# Altium project S7CAS-PLEIADES-CARTE-MERE_P02.PrjPCB (part 3 of 3)

## Sheet S7CAS-PLEIADES-CARTE-MERE_P02_CLOCKS.SchDoc
size Tabloid; DocumentNumber: 12; SheetNumber: 12; SheetTotal: 14; Size: 11x17; Sheet_Name: Horloge
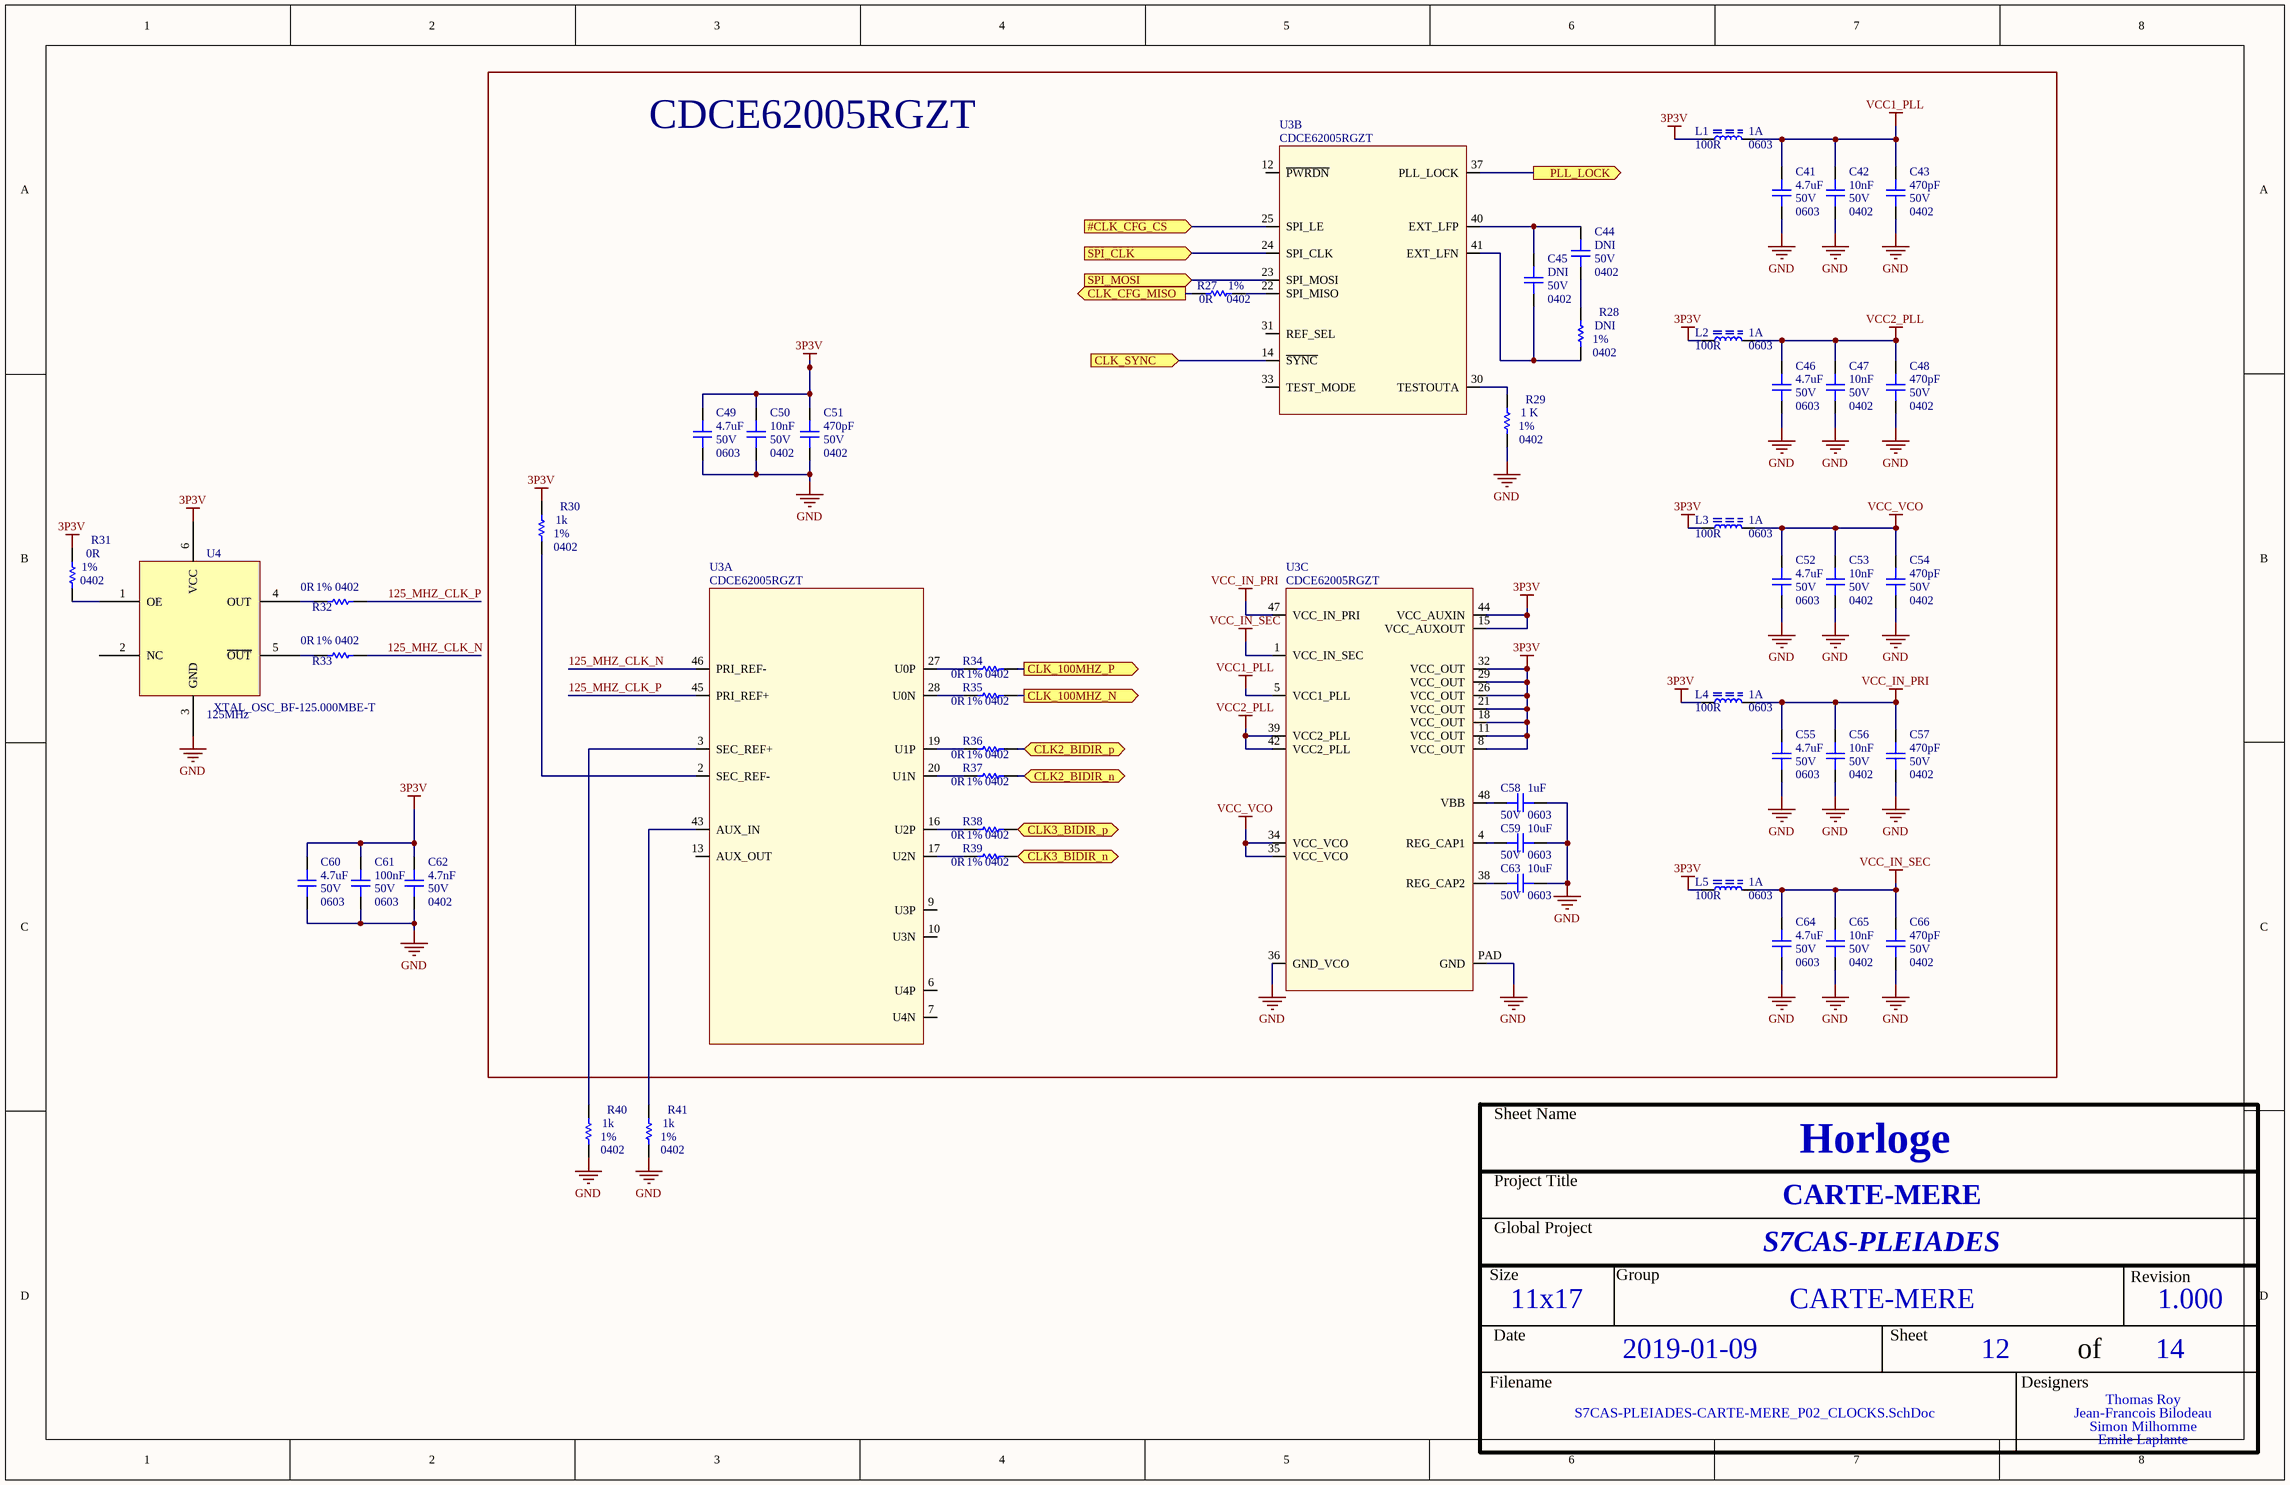
[diagram p10: S7CAS-PLEIADES-CARTE-MERE_P02_CLOCKS.SchDoc]

### Parts
C41  value 4.7uF  Voltage: 50V  Package: 0603  [CAP_0603]  (hidden comment: CAP - 0603)
C42  value 10nF  Voltage: 50V  Package: 0402  [CAP_0402]  (hidden comment: CAP - 0603)
C43  value 470pF  Voltage: 50V  Package: 0402  [CAP_0402]  (hidden comment: CAP - 0603)
C44  value DNI  Voltage: 50V  Package: 0402  [CAP_0402]  (hidden comment: CAP - 0603)
C45  value DNI  Voltage: 50V  Package: 0402  [CAP_0402]  (hidden comment: CAP - 0603)
C46  value 4.7uF  Voltage: 50V  Package: 0603  [CAP_0603]  (hidden comment: CAP - 0603)
C47  value 10nF  Voltage: 50V  Package: 0402  [CAP_0402]  (hidden comment: CAP - 0603)
C48  value 470pF  Voltage: 50V  Package: 0402  [CAP_0402]  (hidden comment: CAP - 0603)
C49  value 4.7uF  Voltage: 50V  Package: 0603  [CAP_0603]  (hidden comment: CAP - 0603)
C50  value 10nF  Voltage: 50V  Package: 0402  [CAP_0402]  (hidden comment: CAP - 0603)
C51  value 470pF  Voltage: 50V  Package: 0402  [CAP_0402]  (hidden comment: CAP - 0603)
C52  value 4.7uF  Voltage: 50V  Package: 0603  [CAP_0603]  (hidden comment: CAP - 0603)
C53  value 10nF  Voltage: 50V  Package: 0402  [CAP_0402]  (hidden comment: CAP - 0603)
C54  value 470pF  Voltage: 50V  Package: 0402  [CAP_0402]  (hidden comment: CAP - 0603)
C55  value 4.7uF  Voltage: 50V  Package: 0603  [CAP_0603]  (hidden comment: CAP - 0603)
C56  value 10nF  Voltage: 50V  Package: 0402  [CAP_0402]  (hidden comment: CAP - 0603)
C57  value 470pF  Voltage: 50V  Package: 0402  [CAP_0402]  (hidden comment: CAP - 0603)
C58  value 1uF  Voltage: 50V  Package: 0603  [CAP_0603]  (hidden comment: CAP - 0603)
C59  value 10uF  Voltage: 50V  Package: 0603  [CAP_0603]  (hidden comment: CAP - 0603)
C60  value 4.7uF  Voltage: 50V  Package: 0603  [CAP_0603]  (hidden comment: CAP - 0603)
C61  value 100nF  Voltage: 50V  Package: 0603  [CAP_0603]  (hidden comment: CAP - 0603)
C62  value 4.7nF  Voltage: 50V  Package: 0402  [CAP_0402]  (hidden comment: CAP - 0603)
C63  value 10uF  Voltage: 50V  Package: 0603  [CAP_0603]  (hidden comment: CAP - 0603)
C64  value 4.7uF  Voltage: 50V  Package: 0603  [CAP_0603]  (hidden comment: CAP - 0603)
C65  value 10nF  Voltage: 50V  Package: 0402  [CAP_0402]  (hidden comment: CAP - 0603)
C66  value 470pF  Voltage: 50V  Package: 0402  [CAP_0402]  (hidden comment: CAP - 0603)
L1  value 100R  Current: 1A  Package: 0603  [FER_0603]  (hidden comment: FER - 0603)
L2  value 100R  Current: 1A  Package: 0603  [FER_0603]  (hidden comment: FER - 0603)
L3  value 100R  Current: 1A  Package: 0603  [FER_0603]  (hidden comment: FER - 0603)
L4  value 100R  Current: 1A  Package: 0603  [FER_0603]  (hidden comment: FER - 0603)
L5  value 100R  Current: 1A  Package: 0603  [FER_0603]  (hidden comment: FER - 0603)
R27  value 0R  Package: 0402  Precision: 1%  [RES_0402]  (hidden comment: RES - 0402)
R28  value DNI  Package: 0402  Precision: 1%  [RES_0402]  (hidden comment: RES - 0402)
R29  value 1 K  Package: 0402  Precision: 1%  [RES_0402]  (hidden comment: RES - 0402)
R30  value 1k  Package: 0402  Precision: 1%  [RES_0402]  (hidden comment: RES - 0402)
R31  value 0R  Package: 0402  Precision: 1%  [RES_0402]  (hidden comment: RES - 0402)
R32  value 0R  Package: 0402  Precision: 1%  [RES_0402]  (hidden comment: RES - 0402)
R33  value 0R  Package: 0402  Precision: 1%  [RES_0402]  (hidden comment: RES - 0402)
R34  value 0R  Package: 0402  Precision: 1%  [RES_0402]  (hidden comment: RES - 0402)
R35  value 0R  Package: 0402  Precision: 1%  [RES_0402]  (hidden comment: RES - 0402)
R36  value 0R  Package: 0402  Precision: 1%  [RES_0402]  (hidden comment: RES - 0402)
R37  value 0R  Package: 0402  Precision: 1%  [RES_0402]  (hidden comment: RES - 0402)
R38  value 0R  Package: 0402  Precision: 1%  [RES_0402]  (hidden comment: RES - 0402)
R39  value 0R  Package: 0402  Precision: 1%  [RES_0402]  (hidden comment: RES - 0402)
R40  value 1k  Package: 0402  Precision: 1%  [RES_0402]  (hidden comment: RES - 0402)
R41  value 1k  Package: 0402  Precision: 1%  [RES_0402]  (hidden comment: RES - 0402)
U3  CDCE62005RGZT  [TIM_CDCE62005RGZT]  (parts A,B,C of 3)
U4  XTAL_OSC_BF-125.000MBE-T  Parameter 1: 125MHz  [BF-125.000MBE-T]

### Blocks framed on the sheet
CDCE62005RGZT: C41-C59 C63-C66 L1-L5 R27-R30 R34-R39 U3

### Ports
#CLK_CFG_CS (in), CLK2_BIDIR_n (bidir), CLK2_BIDIR_p (bidir), CLK3_BIDIR_n (bidir), CLK3_BIDIR_p (bidir), CLK_100MHZ_N (out), CLK_100MHZ_P (out), CLK_CFG_MISO (out), CLK_SYNC (in), PLL_LOCK (out), SPI_CLK (in), SPI_MOSI (in)

### Nets
3P3V: C49.2 C50.2 C51.2 C60.2 C61.2 C62.2 L1.2 L2.2 L3.2 L4.2 L5.2 R30.2 R31.1 U3.8(VCC_OUT) U3.11(VCC_OUT) U3.15(VCC_AUXOUT) U3.18(VCC_OUT) U3.21(VCC_OUT) U3.26(VCC_OUT) U3.29(VCC_OUT) U3.32(VCC_OUT) U3.44(VCC_AUXIN) U4.6(VCC)
GND: C41.1 C42.1 C43.1 C46.1 C47.1 C48.1 C49.1 C50.1 C51.1 C52.1 C53.1 C54.1 C55.1 C56.1 C57.1 C58.1 C59.1 C60.1 C61.1 C62.1 C63.1 C64.1 C65.1 C66.1 R29.1 R40.1 R41.1 U3.36(GND_VCO) U3.PAD(GND) U4.3(GND)
VCC1_PLL: C41.2 C42.2 C43.2 L1.1 U3.5(VCC1_PLL)
VCC2_PLL: C46.2 C47.2 C48.2 L2.1 U3.39(VCC2_PLL) U3.42(VCC2_PLL)
VCC_IN_PRI: C55.2 C56.2 C57.2 L4.1 U3.47(VCC_IN_PRI)
VCC_IN_SEC: C64.2 C65.2 C66.2 L5.1 U3.1(VCC_IN_SEC)
VCC_VCO: C52.2 C53.2 C54.2 L3.1 U3.34(VCC_VCO) U3.35(VCC_VCO)
125_MHZ_CLK_N: R33.1 U3.46(PRI_REF-)
125_MHZ_CLK_P: R32.1 U3.45(PRI_REF+)
#CLK_CFG_CS: U3.25(SPI_LE) ; port #CLK_CFG_CS
CLK2_BIDIR_n: R37.1 ; port CLK2_BIDIR_n
CLK2_BIDIR_p: R36.1 ; port CLK2_BIDIR_p
CLK3_BIDIR_n: R39.1 ; port CLK3_BIDIR_n
CLK3_BIDIR_p: R38.1 ; port CLK3_BIDIR_p
CLK_100MHZ_N: R35.1 ; port CLK_100MHZ_N
CLK_100MHZ_P: R34.1 ; port CLK_100MHZ_P
CLK_CFG_MISO: R27.2 ; port CLK_CFG_MISO
CLK_SYNC: U3.14(~{SYNC}) ; port CLK_SYNC
PLL_LOCK: U3.37(PLL_LOCK) ; port PLL_LOCK
SPI_CLK: U3.24(SPI_CLK) ; port SPI_CLK
SPI_MOSI: U3.23(SPI_MOSI) ; port SPI_MOSI
NetC44_1: C44.1 R28.2
NetC44_2: C44.2 C45.2 U3.40(EXT_LFP)
NetC45_1: C45.1 R28.1 U3.41(EXT_LFN)
NetC58_2: C58.2 U3.48(VBB)
NetC59_2: C59.2 U3.4(REG_CAP1)
NetC63_2: C63.2 U3.38(REG_CAP2)
NetR27_1: R27.1 U3.22(SPI_MISO)
NetR29_2: R29.2 U3.30(TESTOUTA)
NetR30_1: R30.1 U3.2(SEC_REF-)
NetR31_2: R31.2 U4.1(OE)
NetR32_2: R32.2 U4.4(OUT)
NetR33_2: R33.2 U4.5(~{OUT})
NetR34_2: R34.2 U3.27(U0P)
NetR35_2: R35.2 U3.28(U0N)
NetR36_2: R36.2 U3.19(U1P)
NetR37_2: R37.2 U3.20(U1N)
NetR38_2: R38.2 U3.16(U2P)
NetR39_2: R39.2 U3.17(U2N)
NetR40_2: R40.2 U3.3(SEC_REF+)
NetR41_2: R41.2 U3.43(AUX_IN)

Not connected (* = marked no-connect by the designer): U3 6(U4P) 7(U4N) 9(U3P) 10(U3N) 12(~{PWRDN}) 13(AUX_OUT) 31(REF_SEL) 33(TEST_MODE); U4 2(NC)

### Notes on the sheet
- Sheet Name
- Project Title
- Global Project
- Size
- Group
- Revision
- Date
- Sheet
- of
- Filename
- Designers

### Library data of the parts
C41-C66 = CAP - 0603: Precision: 10%; Current: *; CreatedBy: Jonathan Bouchard; Power: *
R27-R41 = RES - 0402: Voltage: 50V; Power: 1/16W; Current: *; CreatedBy: Jonathan Bouchard
U3 = TIM_CDCE62005RGZT: TIM - CLK SYNTH JITTER CLEANER 3:5 - QFN-48; Voltage: 3 V ~ 3.6 V; Mfg: Texas Instruments; Current: *; Power: *; Mfg Part Number: CDCE62005RGZT; HelpURL: http://www.ti.com/lit/ds/symlink/cdce62005.pdf; CreatedBy: Jonathan Bouchard; Temperature: -40°C ~ 85°C; Value: *; Precision: *; Package: QFN-48; Supplier 1: Digikey; Supplier Part Number 1: 296-23947-1-ND
L1-L5 = FER - 0603: Voltage: *; CreatedBy: Jonathan Bouchard; Power: *; Precision: *

## Sheet S7CAS-PLEIADES-CARTE-MERE_P02_FLASH.SchDoc
size Tabloid; DocumentNumber: 13; SheetNumber: 13; SheetTotal: 14; Size: 11x17; Sheet_Name: Flash
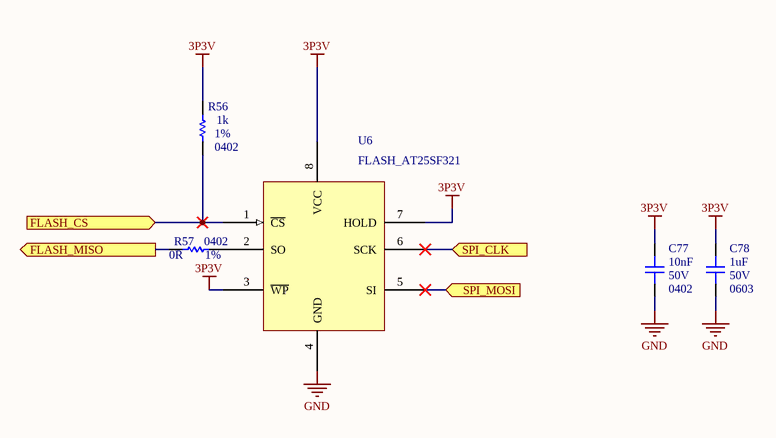
[diagram p11: S7CAS-PLEIADES-CARTE-MERE_P02_FLASH.SchDoc]

### Parts
C77  value 10nF  Voltage: 50V  Package: 0402  [CAP_0402]  (hidden comment: CAP - 0603)
C78  value 1uF  Voltage: 50V  Package: 0603  [CAP_0603]  (hidden comment: CAP - 0603)
R56  value 1k  Package: 0402  Precision: 1%  [RES_0402]  (hidden comment: RES - 0402)
R57  value 0R  Package: 0402  Precision: 1%  [RES_0402]  (hidden comment: RES - 0402)
U6  FLASH_AT25SF321  [8-SOIC]

### Ports
FLASH_CS (in), FLASH_MISO (out), SPI_CLK (in), SPI_MOSI (in)

### Nets
3P3V: C77.2 C78.2 R56.2 U6.3(~{WP}) U6.7(HOLD) U6.8(VCC)
GND: C77.1 C78.1 U6.4(GND)
FLASH_CS: R56.1 U6.1(~{CS}) ; port FLASH_CS
FLASH_MISO: R57.2 ; port FLASH_MISO
SPI_CLK: U6.6(SCK) ; port SPI_CLK
SPI_MOSI: U6.5(SI) ; port SPI_MOSI
NetR57_1: R57.1 U6.2(SO)

### Notes on the sheet
- Sheet Name
- Project Title
- Global Project
- Size
- Group
- Revision
- Date
- Sheet
- of
- Filename
- Designers

### Library data of the parts
C77 C78 = CAP - 0603: Precision: 10%; Current: *; CreatedBy: Jonathan Bouchard; Power: *
R56 R57 = RES - 0402: Voltage: 50V; Power: 1/16W; Current: *; CreatedBy: Jonathan Bouchard

## Sheet S7CAS-PLEIADES-CARTE-MERE_P02_USER_IO.SchDoc
size Tabloid; DocumentNumber: 14; SheetNumber: 14; SheetTotal: 14; Sheet_Name: User IO; Size: 11x17
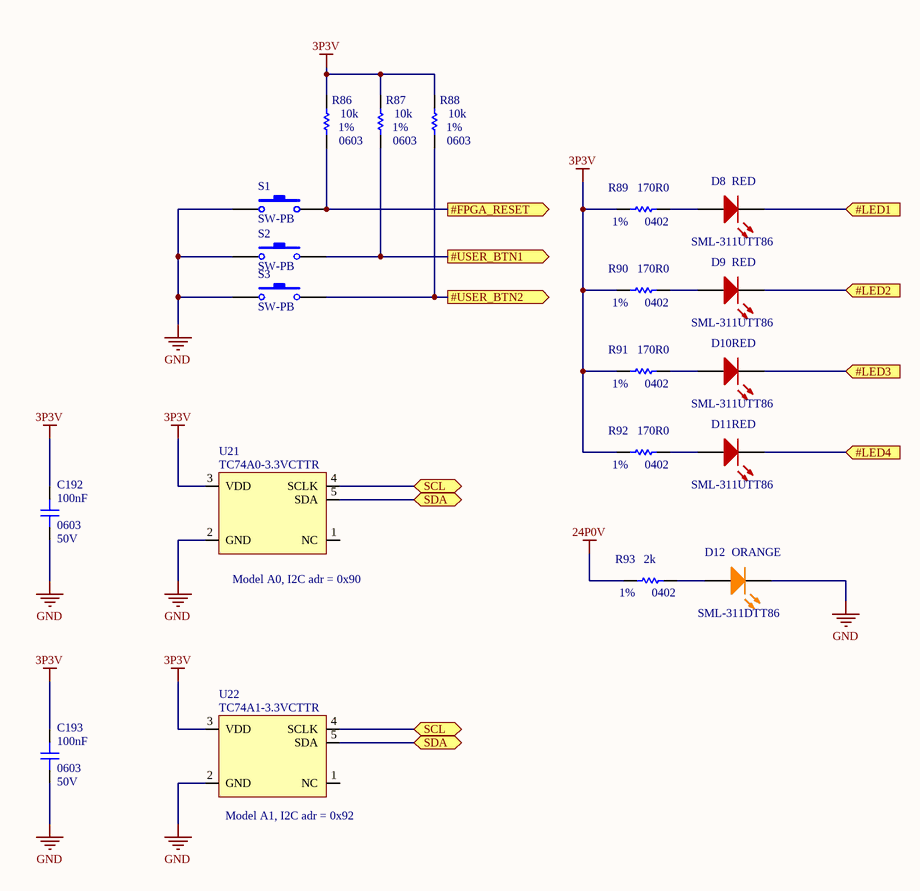
[diagram p12: S7CAS-PLEIADES-CARTE-MERE_P02_USER_IO.SchDoc]

### Parts
C192  value 100nF  Voltage: 50V  Package: 0603  [CAP_0603]  (hidden comment: CAP - 0603)
C193  value 100nF  Voltage: 50V  Package: 0603  [CAP_0603]  (hidden comment: CAP - 0603)
D8  SML-311UTT86  value RED  [LED_0603]
D9  SML-311UTT86  value RED  [LED_0603]
D10  SML-311UTT86  value RED  [LED_0603]
D11  SML-311UTT86  value RED  [LED_0603]
D12  SML-311DTT86  value ORANGE  [LED_0603]
R86  value 10k  Package: 0603  Precision: 1%  [RES_0603]  (hidden comment: RES - 0603)
R87  value 10k  Package: 0603  Precision: 1%  [RES_0603]  (hidden comment: RES - 0603)
R88  value 10k  Package: 0603  Precision: 1%  [RES_0603]  (hidden comment: RES - 0603)
R89  value 170R0  Package: 0402  Precision: 1%  [RES_0402]  (hidden comment: RES - 0402)
R90  value 170R0  Package: 0402  Precision: 1%  [RES_0402]  (hidden comment: RES - 0402)
R91  value 170R0  Package: 0402  Precision: 1%  [RES_0402]  (hidden comment: RES - 0402)
R92  value 170R0  Package: 0402  Precision: 1%  [RES_0402]  (hidden comment: RES - 0402)
R93  value 2k  Package: 0402  Precision: 1%  [RES_0402]  (hidden comment: RES - 0402)
S1  SW-PB  [SPST-2]
S2  SW-PB  [SPST-2]
S3  SW-PB  [SPST-2]
U21  TC74A0-3.3VCTTR  [SEN_TEMP_TC74A0-3.3VCTTR]
U22  TC74A1-3.3VCTTR  [SEN_TEMP_TC74A0-3.3VCTTR]

### Ports
#FPGA_RESET (out), #LED1 (in), #LED2 (in), #LED3 (in), #LED4 (in), #USER_BTN1 (out), #USER_BTN2 (out), SCL (bidir), SDA (bidir)

### Nets
3P3V: C192.2 C193.2 R86.2 R87.2 R88.2 R89.2 R90.2 R91.2 R92.2 U21.3(VDD) U22.3(VDD)
24P0V: R93.2
GND: C192.1 C193.1 D12.K S1.1 S2.1 S3.1 U21.2(GND) U22.2(GND)
#FPGA_RESET: R86.1 S1.2 ; port #FPGA_RESET
#LED1: D8.K ; port #LED1
#LED2: D9.K ; port #LED2
#LED3: D10.K ; port #LED3
#LED4: D11.K ; port #LED4
#USER_BTN1: R87.1 S2.2 ; port #USER_BTN1
#USER_BTN2: R88.1 S3.2 ; port #USER_BTN2
SCL: U21.4(SCLK) U22.4(SCLK) ; port SCL
SDA: U21.5(SDA) U22.5(SDA) ; port SDA
NetD8_A: D8.A R89.1
NetD9_A: D9.A R90.1
NetD10_A: D10.A R91.1
NetD11_A: D11.A R92.1
NetD12_A: D12.A R93.1

Not connected (* = marked no-connect by the designer): U21 1(NC); U22 1(NC)

### Notes on the sheet
- (near U21) Model A0, I2C adr = 0x90
- (near U22) Model A1, I2C adr = 0x92
- Sheet Name
- Project Title
- Global Project
- Size
- Group
- Revision
- Date
- Sheet
- of
- Filename
- Designers

### Library data of the parts
C192 C193 = CAP - 0603: Precision: 10%; Current: *; CreatedBy: Jonathan Bouchard; Power: *
D8-D11 = LED_SML-311UTT86: LED - 620nM RED 2mA - 0603; Voltage: 1.8V; Mfg: ROHM Semiconductor; Power: 44mW; Current: 2mA; HelpURL: http://media.digikey.com/pdf/Data%20Sheets/Rohm%20PDFs/SML-311%20Series.pdf; CreatedBy: Jonathan Bouchard; Temperature: -30°C to 85°C; Package: 0603; Precision: *; Mfg Part Number: SML-311UTT86; Supplier 1: Digikey; Supplier Part Number 1: 511-1304-1-ND
D12 = LED_SML-311DTT86: LED - 611nM ORANGE 2mA - 0603; Voltage: 1.8V; Mfg: ROHM Semiconductor; Power: 44mW; Current: 2mA; HelpURL: http://media.digikey.com/pdf/Data%20Sheets/Rohm%20PDFs/SML-311%20Series.pdf; CreatedBy: Jonathan Bouchard; Temperature: -40°C to 85°C; Package: 0603; Precision: *; Mfg Part Number: SML-311DTT86; Supplier 1: Digikey; Supplier Part Number 1: 511-1303-1-ND
R89-R93 = RES - 0402: Voltage: 50V; Power: 1/16W; Current: *; CreatedBy: Jonathan Bouchard
S1-S3 = SW-PB: Switch; Published: 24-Mar-1999; LatestRevisionDate: 17-Jul-2002; LatestRevisionNote: Re-released for DXP Platform.; PackageReference: SPST-2; Publisher: Altium Limited; PackageDescription: Switch; 2 Leads
U21 U22 = SENS_TEMP_TC74A0-3.3VCTTR: SENS - TEMPERATURE SENSOR I2C/SMBUS - SOT23-5; Voltage: 2.7 V ~ 5.5 V; Mfg: Microchip; Precision: ±2°C (±3°C); Current: *; Power: *; Mfg Part Number: TC74A0-3.3VCTTR; HelpURL: http://ww1.microchip.com/downloads/en/DeviceDoc/21462D.pdf; CreatedBy: Jonathan Bouchard; Temperature: -40°C ~ 125°C; Value: *; Package: SOT23-5; Supplier 1: Digikey; Supplier Part Number 1: TC74A0-3.3VCTDKR-ND
R86-R88 = RES - 0603: Current: *; CreatedBy: Jonathan Bouchard

## Nets that join several sheets
0P75V: S7CAS-PLEIADES-CARTE-MERE_P02_POWER_CARRIER (5 pins), S7CAS-PLEIADES-CARTE-MERE_P02_DDR3 (24 pins)
1P2V: S7CAS-PLEIADES-CARTE-MERE_P02_POWER_CARRIER (5 pins), S7CAS-PLEIADES-CARTE-MERE_P02_FPGA_B4B5 (31 pins)
1P5V: S7CAS-PLEIADES-CARTE-MERE_P02_POWER_CARRIER (10 pins), S7CAS-PLEIADES-CARTE-MERE_P02_FPGA_B2B3 (15 pins), S7CAS-PLEIADES-CARTE-MERE_P02_DDR3 (30 pins)
2P5V: S7CAS-PLEIADES-CARTE-MERE_P02_POWER (10 pins), S7CAS-PLEIADES-CARTE-MERE_P02_POWER_CARRIER (C174.2 C175.2 D7.2 U17.3), S7CAS-PLEIADES-CARTE-MERE_P02_USB (C187.2 J5.B01 R85.2)
3P3V: S7CAS-PLEIADES-CARTE-MERE_P02_POWER (C141.2 C142.2 D5.2 U11.3), S7CAS-PLEIADES-CARTE-MERE_P02_POWER_CARRIER (10 pins), S7CAS-PLEIADES-CARTE-MERE_P02_FPGA_B0B1 (16 pins), S7CAS-PLEIADES-CARTE-MERE_P02_FPGA_B2B3 (15 pins), S7CAS-PLEIADES-CARTE-MERE_P02_FPGA_B4B5 (30 pins), S7CAS-PLEIADES-CARTE-MERE_P02_MOTOR_CTRL (C110.1 L7.2 U7.10), S7CAS-PLEIADES-CARTE-MERE_P02_ETHERNET (7 pins), S7CAS-PLEIADES-CARTE-MERE_P02_USB (8 pins), S7CAS-PLEIADES-CARTE-MERE_P02_CLOCKS (23 pins), S7CAS-PLEIADES-CARTE-MERE_P02_FLASH (6 pins), S7CAS-PLEIADES-CARTE-MERE_P02_USER_IO (11 pins)
3P3V_VITA: S7CAS-PLEIADES-CARTE-MERE_P02_POWER (7 pins), S7CAS-PLEIADES-CARTE-MERE_P02_CONNECTORS (J1.C39 J1.D36 J1.D38 J1.D40)
3P3VAUX: S7CAS-PLEIADES-CARTE-MERE_P02_POWER (6 pins), S7CAS-PLEIADES-CARTE-MERE_P02_CONNECTORS (J1.D32)
5P0V: S7CAS-PLEIADES-CARTE-MERE_P02_POWER (C136.2 C137.2 D4.2 U10.3), S7CAS-PLEIADES-CARTE-MERE_P02_POWER_CARRIER (11 pins)
12P0V: S7CAS-PLEIADES-CARTE-MERE_P02_POWER (C127.1 C128.1 U8.5), S7CAS-PLEIADES-CARTE-MERE_P02_CONNECTORS (J1.C35 J1.C37)
24P0V: S7CAS-PLEIADES-CARTE-MERE_P02_POWER (14 pins), S7CAS-PLEIADES-CARTE-MERE_P02_POWER_CARRIER (10 pins), S7CAS-PLEIADES-CARTE-MERE_P02_MOTOR_CTRL (6 pins), S7CAS-PLEIADES-CARTE-MERE_P02_USER_IO (R93.2)
GND: S7CAS-PLEIADES-CARTE-MERE_P02_POWER (42 pins), S7CAS-PLEIADES-CARTE-MERE_P02_POWER_CARRIER (45 pins), S7CAS-PLEIADES-CARTE-MERE_P02_CONNECTORS (159 pins), S7CAS-PLEIADES-CARTE-MERE_P02_FPGA_B0B1 (11 pins), S7CAS-PLEIADES-CARTE-MERE_P02_FPGA_B2B3 (10 pins), S7CAS-PLEIADES-CARTE-MERE_P02_FPGA_B4B5 (89 pins), S7CAS-PLEIADES-CARTE-MERE_P02_DDR3 (43 pins), S7CAS-PLEIADES-CARTE-MERE_P02_MOTOR_CTRL (20 pins), S7CAS-PLEIADES-CARTE-MERE_P02_ETHERNET (20 pins), S7CAS-PLEIADES-CARTE-MERE_P02_USB (16 pins), S7CAS-PLEIADES-CARTE-MERE_P02_CLOCKS (30 pins), S7CAS-PLEIADES-CARTE-MERE_P02_FLASH (C77.1 C78.1 U6.4), S7CAS-PLEIADES-CARTE-MERE_P02_USER_IO (8 pins)
VADJ: S7CAS-PLEIADES-CARTE-MERE_P02_POWER (6 pins), S7CAS-PLEIADES-CARTE-MERE_P02_CONNECTORS (J1.E39 J1.F40 J1.G39 J1.H40)
VIO_B_M2C: S7CAS-PLEIADES-CARTE-MERE_P02_CONNECTORS (J1.J39 J1.K40), S7CAS-PLEIADES-CARTE-MERE_P02_FPGA_B0B1 (17 pins)
VREF_0V75: S7CAS-PLEIADES-CARTE-MERE_P02_POWER_CARRIER (C182.2 U16.6), S7CAS-PLEIADES-CARTE-MERE_P02_FPGA_B2B3 (U2.AD7 U2.L6 U2.R6 U2.V6), S7CAS-PLEIADES-CARTE-MERE_P02_DDR3 (5 pins)
#CLK_CFG_CS: S7CAS-PLEIADES-CARTE-MERE_P02_FPGA_B2B3 (U2.AE19), S7CAS-PLEIADES-CARTE-MERE_P02_CLOCKS (U3.25)
#FPGA_RESET: S7CAS-PLEIADES-CARTE-MERE_P02_FPGA_B2B3 (U2.AF3), S7CAS-PLEIADES-CARTE-MERE_P02_USER_IO (R86.1 S1.2)
#LED1: S7CAS-PLEIADES-CARTE-MERE_P02_FPGA_B2B3 (U2.Y15), S7CAS-PLEIADES-CARTE-MERE_P02_USER_IO (D8.K)
#LED2: S7CAS-PLEIADES-CARTE-MERE_P02_FPGA_B2B3 (U2.AA15), S7CAS-PLEIADES-CARTE-MERE_P02_USER_IO (D9.K)
#LED3: S7CAS-PLEIADES-CARTE-MERE_P02_FPGA_B2B3 (U2.Y14), S7CAS-PLEIADES-CARTE-MERE_P02_USER_IO (D10.K)
#LED4: S7CAS-PLEIADES-CARTE-MERE_P02_FPGA_B2B3 (U2.AA14), S7CAS-PLEIADES-CARTE-MERE_P02_USER_IO (D11.K)
#MOTOR_ENABLE: S7CAS-PLEIADES-CARTE-MERE_P02_FPGA_B0B1 (U2.R21), S7CAS-PLEIADES-CARTE-MERE_P02_MOTOR_CTRL (U7.26)
#MOTOR_RESET: S7CAS-PLEIADES-CARTE-MERE_P02_FPGA_B0B1 (U2.R22), S7CAS-PLEIADES-CARTE-MERE_P02_MOTOR_CTRL (U7.17)
#MOTOR_SLEEP: S7CAS-PLEIADES-CARTE-MERE_P02_FPGA_B0B1 (U2.P17), S7CAS-PLEIADES-CARTE-MERE_P02_MOTOR_CTRL (U7.27)
#MOTOR_SR: S7CAS-PLEIADES-CARTE-MERE_P02_FPGA_B0B1 (U2.T22), S7CAS-PLEIADES-CARTE-MERE_P02_MOTOR_CTRL (U7.16)
#PHY_RST: S7CAS-PLEIADES-CARTE-MERE_P02_FPGA_B0B1 (U2.M18), S7CAS-PLEIADES-CARTE-MERE_P02_ETHERNET (C73.1 R44.1 U5.32)
#USER_BTN1: S7CAS-PLEIADES-CARTE-MERE_P02_FPGA_B2B3 (U2.AB15), S7CAS-PLEIADES-CARTE-MERE_P02_USER_IO (R87.1 S2.2)
#USER_BTN2: S7CAS-PLEIADES-CARTE-MERE_P02_FPGA_B2B3 (U2.AC14), S7CAS-PLEIADES-CARTE-MERE_P02_USER_IO (R88.1 S3.2)
CK_N: S7CAS-PLEIADES-CARTE-MERE_P02_FPGA_B2B3 (U2.R3), S7CAS-PLEIADES-CARTE-MERE_P02_DDR3 (R18.2 U1.K7)
CK_P: S7CAS-PLEIADES-CARTE-MERE_P02_FPGA_B2B3 (U2.R4), S7CAS-PLEIADES-CARTE-MERE_P02_DDR3 (R18.1 U1.J7)
CLK0_M2C_n: S7CAS-PLEIADES-CARTE-MERE_P02_CONNECTORS (J1.H5), S7CAS-PLEIADES-CARTE-MERE_P02_FPGA_B0B1 (U2.M21)
CLK0_M2C_p: S7CAS-PLEIADES-CARTE-MERE_P02_CONNECTORS (J1.H4), S7CAS-PLEIADES-CARTE-MERE_P02_FPGA_B0B1 (U2.N20)
CLK1_M2C_n: S7CAS-PLEIADES-CARTE-MERE_P02_CONNECTORS (J1.G3), S7CAS-PLEIADES-CARTE-MERE_P02_FPGA_B0B1 (U2.P22)
CLK1_M2C_p: S7CAS-PLEIADES-CARTE-MERE_P02_CONNECTORS (J1.G2), S7CAS-PLEIADES-CARTE-MERE_P02_FPGA_B0B1 (U2.P21)
CLK2_BIDIR_n: S7CAS-PLEIADES-CARTE-MERE_P02_CONNECTORS (J1.K5), S7CAS-PLEIADES-CARTE-MERE_P02_FPGA_B2B3 (U2.AF13), S7CAS-PLEIADES-CARTE-MERE_P02_CLOCKS (R37.1)
CLK2_BIDIR_p: S7CAS-PLEIADES-CARTE-MERE_P02_CONNECTORS (J1.K4), S7CAS-PLEIADES-CARTE-MERE_P02_FPGA_B2B3 (U2.AE13), S7CAS-PLEIADES-CARTE-MERE_P02_CLOCKS (R36.1)
CLK3_BIDIR_n: S7CAS-PLEIADES-CARTE-MERE_P02_CONNECTORS (J1.J3), S7CAS-PLEIADES-CARTE-MERE_P02_FPGA_B2B3 (U2.AF14), S7CAS-PLEIADES-CARTE-MERE_P02_CLOCKS (R39.1)
CLK3_BIDIR_p: S7CAS-PLEIADES-CARTE-MERE_P02_CONNECTORS (J1.J2), S7CAS-PLEIADES-CARTE-MERE_P02_FPGA_B2B3 (U2.AD14), S7CAS-PLEIADES-CARTE-MERE_P02_CLOCKS (R38.1)
CLK_100MHZ_N: S7CAS-PLEIADES-CARTE-MERE_P02_FPGA_B0B1 (U2.W24), S7CAS-PLEIADES-CARTE-MERE_P02_CLOCKS (R35.1)
CLK_100MHZ_P: S7CAS-PLEIADES-CARTE-MERE_P02_FPGA_B0B1 (U2.V23), S7CAS-PLEIADES-CARTE-MERE_P02_CLOCKS (R34.1)
CLK_CFG_MISO: S7CAS-PLEIADES-CARTE-MERE_P02_FPGA_B2B3 (U2.AF20), S7CAS-PLEIADES-CARTE-MERE_P02_CLOCKS (R27.2)
CLK_DIR: S7CAS-PLEIADES-CARTE-MERE_P02_CONNECTORS (J1.B1), S7CAS-PLEIADES-CARTE-MERE_P02_FPGA_B2B3 (U2.AF19)
CLK_SYNC: S7CAS-PLEIADES-CARTE-MERE_P02_FPGA_B2B3 (U2.AC16), S7CAS-PLEIADES-CARTE-MERE_P02_CLOCKS (U3.14)
DDR3_A0: S7CAS-PLEIADES-CARTE-MERE_P02_FPGA_B2B3 (U2.N7), S7CAS-PLEIADES-CARTE-MERE_P02_DDR3 (R1.1 U1.N3)
DDR3_A1: S7CAS-PLEIADES-CARTE-MERE_P02_FPGA_B2B3 (U2.N6), S7CAS-PLEIADES-CARTE-MERE_P02_DDR3 (R2.1 U1.P7)
DDR3_A2: S7CAS-PLEIADES-CARTE-MERE_P02_FPGA_B2B3 (U2.R9), S7CAS-PLEIADES-CARTE-MERE_P02_DDR3 (R3.1 U1.P3)
DDR3_A3: S7CAS-PLEIADES-CARTE-MERE_P02_FPGA_B2B3 (U2.P7), S7CAS-PLEIADES-CARTE-MERE_P02_DDR3 (R4.1 U1.N2)
DDR3_A4: S7CAS-PLEIADES-CARTE-MERE_P02_FPGA_B2B3 (U2.N9), S7CAS-PLEIADES-CARTE-MERE_P02_DDR3 (R5.1 U1.P8)
DDR3_A5: S7CAS-PLEIADES-CARTE-MERE_P02_FPGA_B2B3 (U2.R2), S7CAS-PLEIADES-CARTE-MERE_P02_DDR3 (R6.1 U1.P2)
DDR3_A6: S7CAS-PLEIADES-CARTE-MERE_P02_FPGA_B2B3 (U2.R1), S7CAS-PLEIADES-CARTE-MERE_P02_DDR3 (R7.1 U1.R8)
DDR3_A7: S7CAS-PLEIADES-CARTE-MERE_P02_FPGA_B2B3 (U2.P10), S7CAS-PLEIADES-CARTE-MERE_P02_DDR3 (R8.1 U1.R2)
DDR3_A8: S7CAS-PLEIADES-CARTE-MERE_P02_FPGA_B2B3 (U2.N4), S7CAS-PLEIADES-CARTE-MERE_P02_DDR3 (R9.1 U1.T8)
DDR3_A9: S7CAS-PLEIADES-CARTE-MERE_P02_FPGA_B2B3 (U2.N3), S7CAS-PLEIADES-CARTE-MERE_P02_DDR3 (R10.1 U1.R3)
DDR3_A10: S7CAS-PLEIADES-CARTE-MERE_P02_FPGA_B2B3 (U2.M10), S7CAS-PLEIADES-CARTE-MERE_P02_DDR3 (R11.1 U1.L7)
DDR3_A11: S7CAS-PLEIADES-CARTE-MERE_P02_FPGA_B2B3 (U2.L3), S7CAS-PLEIADES-CARTE-MERE_P02_DDR3 (R12.1 U1.R7)
DDR3_A12: S7CAS-PLEIADES-CARTE-MERE_P02_FPGA_B2B3 (U2.M8), S7CAS-PLEIADES-CARTE-MERE_P02_DDR3 (R13.1 U1.N7)
DDR3_A13: S7CAS-PLEIADES-CARTE-MERE_P02_FPGA_B2B3 (U2.M6), S7CAS-PLEIADES-CARTE-MERE_P02_DDR3 (R14.1 U1.T3)
DDR3_BA0: S7CAS-PLEIADES-CARTE-MERE_P02_FPGA_B2B3 (U2.P3), S7CAS-PLEIADES-CARTE-MERE_P02_DDR3 (R15.1 U1.M2)
DDR3_BA1: S7CAS-PLEIADES-CARTE-MERE_P02_FPGA_B2B3 (U2.P1), S7CAS-PLEIADES-CARTE-MERE_P02_DDR3 (R16.1 U1.N8)
DDR3_BA2: S7CAS-PLEIADES-CARTE-MERE_P02_FPGA_B2B3 (U2.N5), S7CAS-PLEIADES-CARTE-MERE_P02_DDR3 (R17.1 U1.M3)
DDR3_DQ0: S7CAS-PLEIADES-CARTE-MERE_P02_FPGA_B2B3 (U2.Y3), S7CAS-PLEIADES-CARTE-MERE_P02_DDR3 (U1.E3)
DDR3_DQ1: S7CAS-PLEIADES-CARTE-MERE_P02_FPGA_B2B3 (U2.Y1), S7CAS-PLEIADES-CARTE-MERE_P02_DDR3 (U1.F7)
DDR3_DQ2: S7CAS-PLEIADES-CARTE-MERE_P02_FPGA_B2B3 (U2.W2), S7CAS-PLEIADES-CARTE-MERE_P02_DDR3 (U1.F2)
DDR3_DQ3: S7CAS-PLEIADES-CARTE-MERE_P02_FPGA_B2B3 (U2.W1), S7CAS-PLEIADES-CARTE-MERE_P02_DDR3 (U1.F8)
DDR3_DQ4: S7CAS-PLEIADES-CARTE-MERE_P02_FPGA_B2B3 (U2.T3), S7CAS-PLEIADES-CARTE-MERE_P02_DDR3 (U1.H3)
DDR3_DQ5: S7CAS-PLEIADES-CARTE-MERE_P02_FPGA_B2B3 (U2.T1), S7CAS-PLEIADES-CARTE-MERE_P02_DDR3 (U1.H8)
DDR3_DQ6: S7CAS-PLEIADES-CARTE-MERE_P02_FPGA_B2B3 (U2.U2), S7CAS-PLEIADES-CARTE-MERE_P02_DDR3 (U1.G2)
DDR3_DQ7: S7CAS-PLEIADES-CARTE-MERE_P02_FPGA_B2B3 (U2.U1), S7CAS-PLEIADES-CARTE-MERE_P02_DDR3 (U1.H7)
DDR3_DQ8: S7CAS-PLEIADES-CARTE-MERE_P02_FPGA_B2B3 (U2.AA2), S7CAS-PLEIADES-CARTE-MERE_P02_DDR3 (U1.D7)
DDR3_DQ9: S7CAS-PLEIADES-CARTE-MERE_P02_FPGA_B2B3 (U2.AA1), S7CAS-PLEIADES-CARTE-MERE_P02_DDR3 (U1.C3)
DDR3_DQ10: S7CAS-PLEIADES-CARTE-MERE_P02_FPGA_B2B3 (U2.AE2), S7CAS-PLEIADES-CARTE-MERE_P02_DDR3 (U1.C8)
DDR3_DQ11: S7CAS-PLEIADES-CARTE-MERE_P02_FPGA_B2B3 (U2.AE1), S7CAS-PLEIADES-CARTE-MERE_P02_DDR3 (U1.C2)
DDR3_DQ12: S7CAS-PLEIADES-CARTE-MERE_P02_FPGA_B2B3 (U2.AD3), S7CAS-PLEIADES-CARTE-MERE_P02_DDR3 (U1.A7)
DDR3_DQ13: S7CAS-PLEIADES-CARTE-MERE_P02_FPGA_B2B3 (U2.AD1), S7CAS-PLEIADES-CARTE-MERE_P02_DDR3 (U1.A2)
DDR3_DQ14: S7CAS-PLEIADES-CARTE-MERE_P02_FPGA_B2B3 (U2.AB3), S7CAS-PLEIADES-CARTE-MERE_P02_DDR3 (U1.B8)
DDR3_DQ15: S7CAS-PLEIADES-CARTE-MERE_P02_FPGA_B2B3 (U2.AB1), S7CAS-PLEIADES-CARTE-MERE_P02_DDR3 (U1.A3)
FLASH_CS: S7CAS-PLEIADES-CARTE-MERE_P02_FPGA_B2B3 (U2.AC22), S7CAS-PLEIADES-CARTE-MERE_P02_FLASH (R56.1 U6.1)
FLASH_MISO: S7CAS-PLEIADES-CARTE-MERE_P02_FPGA_B2B3 (U2.AD20), S7CAS-PLEIADES-CARTE-MERE_P02_FLASH (R57.2)
GA0: S7CAS-PLEIADES-CARTE-MERE_P02_CONNECTORS (J1.C34), S7CAS-PLEIADES-CARTE-MERE_P02_FPGA_B0B1 (U2.M23)
GA1: S7CAS-PLEIADES-CARTE-MERE_P02_CONNECTORS (J1.D35), S7CAS-PLEIADES-CARTE-MERE_P02_FPGA_B0B1 (U2.N24)
HA00_CC_n: S7CAS-PLEIADES-CARTE-MERE_P02_CONNECTORS (J1.F5), S7CAS-PLEIADES-CARTE-MERE_P02_FPGA_B2B3 (U2.AD13)
HA00_CC_p: S7CAS-PLEIADES-CARTE-MERE_P02_CONNECTORS (J1.F4), S7CAS-PLEIADES-CARTE-MERE_P02_FPGA_B2B3 (U2.AC13)
HA01_CC_n: S7CAS-PLEIADES-CARTE-MERE_P02_CONNECTORS (J1.E3), S7CAS-PLEIADES-CARTE-MERE_P02_FPGA_B2B3 (U2.AF12)
HA01_CC_p: S7CAS-PLEIADES-CARTE-MERE_P02_CONNECTORS (J1.E2), S7CAS-PLEIADES-CARTE-MERE_P02_FPGA_B2B3 (U2.AD12)
HA02_n: S7CAS-PLEIADES-CARTE-MERE_P02_CONNECTORS (J1.K8), S7CAS-PLEIADES-CARTE-MERE_P02_FPGA_B2B3 (U2.Y13)
HA02_p: S7CAS-PLEIADES-CARTE-MERE_P02_CONNECTORS (J1.K7), S7CAS-PLEIADES-CARTE-MERE_P02_FPGA_B2B3 (U2.W13)
HA03_n: S7CAS-PLEIADES-CARTE-MERE_P02_CONNECTORS (J1.J7), S7CAS-PLEIADES-CARTE-MERE_P02_FPGA_B2B3 (U2.AB13)
HA03_p: S7CAS-PLEIADES-CARTE-MERE_P02_CONNECTORS (J1.J6), S7CAS-PLEIADES-CARTE-MERE_P02_FPGA_B2B3 (U2.AA13)
HA04_n: S7CAS-PLEIADES-CARTE-MERE_P02_CONNECTORS (J1.F8), S7CAS-PLEIADES-CARTE-MERE_P02_FPGA_B2B3 (U2.AC12)
HA04_p: S7CAS-PLEIADES-CARTE-MERE_P02_CONNECTORS (J1.F7), S7CAS-PLEIADES-CARTE-MERE_P02_FPGA_B2B3 (U2.AA12)
HA05_n: S7CAS-PLEIADES-CARTE-MERE_P02_CONNECTORS (J1.E7), S7CAS-PLEIADES-CARTE-MERE_P02_FPGA_B2B3 (U2.V14)
HA05_p: S7CAS-PLEIADES-CARTE-MERE_P02_CONNECTORS (J1.E6), S7CAS-PLEIADES-CARTE-MERE_P02_FPGA_B2B3 (U2.U15)
HA06_n: S7CAS-PLEIADES-CARTE-MERE_P02_CONNECTORS (J1.K11), S7CAS-PLEIADES-CARTE-MERE_P02_FPGA_B2B3 (U2.AB11)
HA06_p: S7CAS-PLEIADES-CARTE-MERE_P02_CONNECTORS (J1.K10), S7CAS-PLEIADES-CARTE-MERE_P02_FPGA_B2B3 (U2.AA11)
HA07_n: S7CAS-PLEIADES-CARTE-MERE_P02_CONNECTORS (J1.J10), S7CAS-PLEIADES-CARTE-MERE_P02_FPGA_B2B3 (U2.W14)
HA07_p: S7CAS-PLEIADES-CARTE-MERE_P02_CONNECTORS (J1.J9), S7CAS-PLEIADES-CARTE-MERE_P02_FPGA_B2B3 (U2.V13)
HA08_n: S7CAS-PLEIADES-CARTE-MERE_P02_CONNECTORS (J1.F11), S7CAS-PLEIADES-CARTE-MERE_P02_FPGA_B2B3 (U2.AD11)
HA08_p: S7CAS-PLEIADES-CARTE-MERE_P02_CONNECTORS (J1.F10), S7CAS-PLEIADES-CARTE-MERE_P02_FPGA_B2B3 (U2.AC11)
HA09_n: S7CAS-PLEIADES-CARTE-MERE_P02_CONNECTORS (J1.E10), S7CAS-PLEIADES-CARTE-MERE_P02_FPGA_B2B3 (U2.W12)
HA09_p: S7CAS-PLEIADES-CARTE-MERE_P02_CONNECTORS (J1.E9), S7CAS-PLEIADES-CARTE-MERE_P02_FPGA_B2B3 (U2.V12)
HA10_n: S7CAS-PLEIADES-CARTE-MERE_P02_CONNECTORS (J1.K14), S7CAS-PLEIADES-CARTE-MERE_P02_FPGA_B2B3 (U2.AF11)
HA10_p: S7CAS-PLEIADES-CARTE-MERE_P02_CONNECTORS (J1.K13), S7CAS-PLEIADES-CARTE-MERE_P02_FPGA_B2B3 (U2.AE11)
HA11_n: S7CAS-PLEIADES-CARTE-MERE_P02_CONNECTORS (J1.J13), S7CAS-PLEIADES-CARTE-MERE_P02_FPGA_B2B3 (U2.AF9)
HA11_p: S7CAS-PLEIADES-CARTE-MERE_P02_CONNECTORS (J1.J12), S7CAS-PLEIADES-CARTE-MERE_P02_FPGA_B2B3 (U2.AE9)
HA12_n: S7CAS-PLEIADES-CARTE-MERE_P02_CONNECTORS (J1.F14), S7CAS-PLEIADES-CARTE-MERE_P02_FPGA_B2B3 (U2.AF10)
HA12_p: S7CAS-PLEIADES-CARTE-MERE_P02_CONNECTORS (J1.F13), S7CAS-PLEIADES-CARTE-MERE_P02_FPGA_B2B3 (U2.AD10)
HA13_n: S7CAS-PLEIADES-CARTE-MERE_P02_CONNECTORS (J1.E13), S7CAS-PLEIADES-CARTE-MERE_P02_FPGA_B2B3 (U2.U12)
HA13_p: S7CAS-PLEIADES-CARTE-MERE_P02_CONNECTORS (J1.E12), S7CAS-PLEIADES-CARTE-MERE_P02_FPGA_B2B3 (U2.U13)
HA14_n: S7CAS-PLEIADES-CARTE-MERE_P02_CONNECTORS (J1.J16), S7CAS-PLEIADES-CARTE-MERE_P02_FPGA_B2B3 (U2.AB10)
HA14_p: S7CAS-PLEIADES-CARTE-MERE_P02_CONNECTORS (J1.J15), S7CAS-PLEIADES-CARTE-MERE_P02_FPGA_B2B3 (U2.Y10)
HA15_n: S7CAS-PLEIADES-CARTE-MERE_P02_CONNECTORS (J1.F17), S7CAS-PLEIADES-CARTE-MERE_P02_FPGA_B2B3 (U2.W11)
HA15_p: S7CAS-PLEIADES-CARTE-MERE_P02_CONNECTORS (J1.F16), S7CAS-PLEIADES-CARTE-MERE_P02_FPGA_B2B3 (U2.V11)
HA16_n: S7CAS-PLEIADES-CARTE-MERE_P02_CONNECTORS (J1.E16), S7CAS-PLEIADES-CARTE-MERE_P02_FPGA_B2B3 (U2.AF8)
HA16_p: S7CAS-PLEIADES-CARTE-MERE_P02_CONNECTORS (J1.E15), S7CAS-PLEIADES-CARTE-MERE_P02_FPGA_B2B3 (U2.AD8)
HA17_CC_n: S7CAS-PLEIADES-CARTE-MERE_P02_CONNECTORS (J1.K17), S7CAS-PLEIADES-CARTE-MERE_P02_FPGA_B2B3 (U2.W16)
HA17_CC_p: S7CAS-PLEIADES-CARTE-MERE_P02_CONNECTORS (J1.K16), S7CAS-PLEIADES-CARTE-MERE_P02_FPGA_B2B3 (U2.V15)
HA18_n: S7CAS-PLEIADES-CARTE-MERE_P02_CONNECTORS (J1.J19), S7CAS-PLEIADES-CARTE-MERE_P02_FPGA_B2B3 (U2.AD9)
HA18_p: S7CAS-PLEIADES-CARTE-MERE_P02_CONNECTORS (J1.J18), S7CAS-PLEIADES-CARTE-MERE_P02_FPGA_B2B3 (U2.AC9)
HA19_n: S7CAS-PLEIADES-CARTE-MERE_P02_CONNECTORS (J1.F20), S7CAS-PLEIADES-CARTE-MERE_P02_FPGA_B2B3 (U2.AB9)
HA19_p: S7CAS-PLEIADES-CARTE-MERE_P02_CONNECTORS (J1.F19), S7CAS-PLEIADES-CARTE-MERE_P02_FPGA_B2B3 (U2.AA9)
HA20_n: S7CAS-PLEIADES-CARTE-MERE_P02_CONNECTORS (J1.E19), S7CAS-PLEIADES-CARTE-MERE_P02_FPGA_B2B3 (U2.AF7)
HA20_p: S7CAS-PLEIADES-CARTE-MERE_P02_CONNECTORS (J1.E18), S7CAS-PLEIADES-CARTE-MERE_P02_FPGA_B2B3 (U2.AE7)
HA21_n: S7CAS-PLEIADES-CARTE-MERE_P02_CONNECTORS (J1.K20), S7CAS-PLEIADES-CARTE-MERE_P02_FPGA_B2B3 (U2.AF6)
HA21_p: S7CAS-PLEIADES-CARTE-MERE_P02_CONNECTORS (J1.K19), S7CAS-PLEIADES-CARTE-MERE_P02_FPGA_B2B3 (U2.AD6)
HA22_n: S7CAS-PLEIADES-CARTE-MERE_P02_CONNECTORS (J1.J22), S7CAS-PLEIADES-CARTE-MERE_P02_FPGA_B2B3 (U2.AF5)
HA22_p: S7CAS-PLEIADES-CARTE-MERE_P02_CONNECTORS (J1.J21), S7CAS-PLEIADES-CARTE-MERE_P02_FPGA_B2B3 (U2.AE5)
HA23_n: S7CAS-PLEIADES-CARTE-MERE_P02_CONNECTORS (J1.K23), S7CAS-PLEIADES-CARTE-MERE_P02_FPGA_B2B3 (U2.AF4)
HA23_p: S7CAS-PLEIADES-CARTE-MERE_P02_CONNECTORS (J1.K22), S7CAS-PLEIADES-CARTE-MERE_P02_FPGA_B2B3 (U2.AE4)
HB00_CC_n: S7CAS-PLEIADES-CARTE-MERE_P02_CONNECTORS (J1.K26), S7CAS-PLEIADES-CARTE-MERE_P02_FPGA_B0B1 (U2.A13)
HB00_CC_p: S7CAS-PLEIADES-CARTE-MERE_P02_CONNECTORS (J1.K25), S7CAS-PLEIADES-CARTE-MERE_P02_FPGA_B0B1 (U2.C13)
HB01_n: S7CAS-PLEIADES-CARTE-MERE_P02_CONNECTORS (J1.J25), S7CAS-PLEIADES-CARTE-MERE_P02_FPGA_B0B1 (U2.A4)
HB01_p: S7CAS-PLEIADES-CARTE-MERE_P02_CONNECTORS (J1.J24), S7CAS-PLEIADES-CARTE-MERE_P02_FPGA_B0B1 (U2.B4)
HB02_n: S7CAS-PLEIADES-CARTE-MERE_P02_CONNECTORS (J1.F23), S7CAS-PLEIADES-CARTE-MERE_P02_FPGA_B0B1 (U2.D5)
HB02_p: S7CAS-PLEIADES-CARTE-MERE_P02_CONNECTORS (J1.F22), S7CAS-PLEIADES-CARTE-MERE_P02_FPGA_B0B1 (U2.E6)
HB03_n: S7CAS-PLEIADES-CARTE-MERE_P02_CONNECTORS (J1.E22), S7CAS-PLEIADES-CARTE-MERE_P02_FPGA_B0B1 (U2.A5)
HB03_p: S7CAS-PLEIADES-CARTE-MERE_P02_CONNECTORS (J1.E21), S7CAS-PLEIADES-CARTE-MERE_P02_FPGA_B0B1 (U2.C5)
HB04_n: S7CAS-PLEIADES-CARTE-MERE_P02_CONNECTORS (J1.F26), S7CAS-PLEIADES-CARTE-MERE_P02_FPGA_B0B1 (U2.F7)
HB04_p: S7CAS-PLEIADES-CARTE-MERE_P02_CONNECTORS (J1.F25), S7CAS-PLEIADES-CARTE-MERE_P02_FPGA_B0B1 (U2.G8)
HB05_n: S7CAS-PLEIADES-CARTE-MERE_P02_CONNECTORS (J1.E25), S7CAS-PLEIADES-CARTE-MERE_P02_FPGA_B0B1 (U2.A6)
HB05_p: S7CAS-PLEIADES-CARTE-MERE_P02_CONNECTORS (J1.E24), S7CAS-PLEIADES-CARTE-MERE_P02_FPGA_B0B1 (U2.B6)
HB06_CC_n: S7CAS-PLEIADES-CARTE-MERE_P02_CONNECTORS (J1.K29), S7CAS-PLEIADES-CARTE-MERE_P02_FPGA_B0B1 (U2.C14)
HB06_CC_p: S7CAS-PLEIADES-CARTE-MERE_P02_CONNECTORS (J1.K28), S7CAS-PLEIADES-CARTE-MERE_P02_FPGA_B0B1 (U2.D14)
HB07_n: S7CAS-PLEIADES-CARTE-MERE_P02_CONNECTORS (J1.J28), S7CAS-PLEIADES-CARTE-MERE_P02_FPGA_B0B1 (U2.A7)
HB07_p: S7CAS-PLEIADES-CARTE-MERE_P02_CONNECTORS (J1.J27), S7CAS-PLEIADES-CARTE-MERE_P02_FPGA_B0B1 (U2.C7)
HB08_n: S7CAS-PLEIADES-CARTE-MERE_P02_CONNECTORS (J1.F29), S7CAS-PLEIADES-CARTE-MERE_P02_FPGA_B0B1 (U2.C6)
HB08_p: S7CAS-PLEIADES-CARTE-MERE_P02_CONNECTORS (J1.F28), S7CAS-PLEIADES-CARTE-MERE_P02_FPGA_B0B1 (U2.D6)
HB09_n: S7CAS-PLEIADES-CARTE-MERE_P02_CONNECTORS (J1.E28), S7CAS-PLEIADES-CARTE-MERE_P02_FPGA_B0B1 (U2.D7)
HB09_p: S7CAS-PLEIADES-CARTE-MERE_P02_CONNECTORS (J1.E27), S7CAS-PLEIADES-CARTE-MERE_P02_FPGA_B0B1 (U2.E8)
HB10_n: S7CAS-PLEIADES-CARTE-MERE_P02_CONNECTORS (J1.K32), S7CAS-PLEIADES-CARTE-MERE_P02_FPGA_B0B1 (U2.C8)
HB10_p: S7CAS-PLEIADES-CARTE-MERE_P02_CONNECTORS (J1.K31), S7CAS-PLEIADES-CARTE-MERE_P02_FPGA_B0B1 (U2.D8)
HB11_n: S7CAS-PLEIADES-CARTE-MERE_P02_CONNECTORS (J1.J31), S7CAS-PLEIADES-CARTE-MERE_P02_FPGA_B0B1 (U2.E9)
HB11_p: S7CAS-PLEIADES-CARTE-MERE_P02_CONNECTORS (J1.J30), S7CAS-PLEIADES-CARTE-MERE_P02_FPGA_B0B1 (U2.F9)
HB12_n: S7CAS-PLEIADES-CARTE-MERE_P02_CONNECTORS (J1.F32), S7CAS-PLEIADES-CARTE-MERE_P02_FPGA_B0B1 (U2.A8)
HB12_p: S7CAS-PLEIADES-CARTE-MERE_P02_CONNECTORS (J1.F31), S7CAS-PLEIADES-CARTE-MERE_P02_FPGA_B0B1 (U2.B8)
HB13_n: S7CAS-PLEIADES-CARTE-MERE_P02_CONNECTORS (J1.E31), S7CAS-PLEIADES-CARTE-MERE_P02_FPGA_B0B1 (U2.A9)
HB13_p: S7CAS-PLEIADES-CARTE-MERE_P02_CONNECTORS (J1.E30), S7CAS-PLEIADES-CARTE-MERE_P02_FPGA_B0B1 (U2.C9)
HB14_n: S7CAS-PLEIADES-CARTE-MERE_P02_CONNECTORS (J1.K35), S7CAS-PLEIADES-CARTE-MERE_P02_FPGA_B0B1 (U2.F10)
HB14_p: S7CAS-PLEIADES-CARTE-MERE_P02_CONNECTORS (J1.K34), S7CAS-PLEIADES-CARTE-MERE_P02_FPGA_B0B1 (U2.E10)
HB15_n: S7CAS-PLEIADES-CARTE-MERE_P02_CONNECTORS (J1.J34), S7CAS-PLEIADES-CARTE-MERE_P02_FPGA_B0B1 (U2.C10)
HB15_p: S7CAS-PLEIADES-CARTE-MERE_P02_CONNECTORS (J1.J33), S7CAS-PLEIADES-CARTE-MERE_P02_FPGA_B0B1 (U2.D10)
HB16_n: S7CAS-PLEIADES-CARTE-MERE_P02_CONNECTORS (J1.F35), S7CAS-PLEIADES-CARTE-MERE_P02_FPGA_B0B1 (U2.A10)
HB16_p: S7CAS-PLEIADES-CARTE-MERE_P02_CONNECTORS (J1.F34), S7CAS-PLEIADES-CARTE-MERE_P02_FPGA_B0B1 (U2.B10)
HB17_CC_n: S7CAS-PLEIADES-CARTE-MERE_P02_CONNECTORS (J1.K38), S7CAS-PLEIADES-CARTE-MERE_P02_FPGA_B0B1 (U2.A14)
HB17_CC_p: S7CAS-PLEIADES-CARTE-MERE_P02_CONNECTORS (J1.K37), S7CAS-PLEIADES-CARTE-MERE_P02_FPGA_B0B1 (U2.B14)
HB18_n: S7CAS-PLEIADES-CARTE-MERE_P02_CONNECTORS (J1.J37), S7CAS-PLEIADES-CARTE-MERE_P02_FPGA_B0B1 (U2.F11)
HB18_p: S7CAS-PLEIADES-CARTE-MERE_P02_CONNECTORS (J1.J36), S7CAS-PLEIADES-CARTE-MERE_P02_FPGA_B0B1 (U2.D11)
HB19_n: S7CAS-PLEIADES-CARTE-MERE_P02_CONNECTORS (J1.E34), S7CAS-PLEIADES-CARTE-MERE_P02_FPGA_B0B1 (U2.A11)
HB19_p: S7CAS-PLEIADES-CARTE-MERE_P02_CONNECTORS (J1.E33), S7CAS-PLEIADES-CARTE-MERE_P02_FPGA_B0B1 (U2.C11)
HB20_n: S7CAS-PLEIADES-CARTE-MERE_P02_CONNECTORS (J1.F38), S7CAS-PLEIADES-CARTE-MERE_P02_FPGA_B0B1 (U2.A12)
HB20_p: S7CAS-PLEIADES-CARTE-MERE_P02_CONNECTORS (J1.F37), S7CAS-PLEIADES-CARTE-MERE_P02_FPGA_B0B1 (U2.B12)
HB21_n: S7CAS-PLEIADES-CARTE-MERE_P02_CONNECTORS (J1.E37), S7CAS-PLEIADES-CARTE-MERE_P02_FPGA_B0B1 (U2.C12)
HB21_p: S7CAS-PLEIADES-CARTE-MERE_P02_CONNECTORS (J1.E36), S7CAS-PLEIADES-CARTE-MERE_P02_FPGA_B0B1 (U2.D12)
JTAG_TCK: S7CAS-PLEIADES-CARTE-MERE_P02_CONNECTORS (J1.D29), S7CAS-PLEIADES-CARTE-MERE_P02_FPGA_B4B5 (U2.E21), S7CAS-PLEIADES-CARTE-MERE_P02_USB (J5.B03 R85.1 U18.14)
JTAG_TDI: S7CAS-PLEIADES-CARTE-MERE_P02_CONNECTORS (J1.D30), S7CAS-PLEIADES-CARTE-MERE_P02_FPGA_B4B5 (U2.F20), S7CAS-PLEIADES-CARTE-MERE_P02_USB (J5.B05 U18.13)
JTAG_TDO: S7CAS-PLEIADES-CARTE-MERE_P02_CONNECTORS (J1.D31), S7CAS-PLEIADES-CARTE-MERE_P02_FPGA_B4B5 (U2.A24), S7CAS-PLEIADES-CARTE-MERE_P02_USB (J5.B04 U18.11)
JTAG_TMS: S7CAS-PLEIADES-CARTE-MERE_P02_CONNECTORS (J1.D33), S7CAS-PLEIADES-CARTE-MERE_P02_FPGA_B4B5 (U2.C23), S7CAS-PLEIADES-CARTE-MERE_P02_USB (J5.B02 U18.12)
LA00_CC_n: S7CAS-PLEIADES-CARTE-MERE_P02_CONNECTORS (J1.G7), S7CAS-PLEIADES-CARTE-MERE_P02_FPGA_B0B1 (U2.A15)
LA00_CC_p: S7CAS-PLEIADES-CARTE-MERE_P02_CONNECTORS (J1.G6), S7CAS-PLEIADES-CARTE-MERE_P02_FPGA_B0B1 (U2.C15)
LA01_CC_n: S7CAS-PLEIADES-CARTE-MERE_P02_CONNECTORS (J1.D9), S7CAS-PLEIADES-CARTE-MERE_P02_FPGA_B0B1 (U2.A16)
LA01_CC_p: S7CAS-PLEIADES-CARTE-MERE_P02_CONNECTORS (J1.D8), S7CAS-PLEIADES-CARTE-MERE_P02_FPGA_B0B1 (U2.B16)
LA02_n: S7CAS-PLEIADES-CARTE-MERE_P02_CONNECTORS (J1.H8), S7CAS-PLEIADES-CARTE-MERE_P02_FPGA_B0B1 (U2.G14)
LA02_p: S7CAS-PLEIADES-CARTE-MERE_P02_CONNECTORS (J1.H7), S7CAS-PLEIADES-CARTE-MERE_P02_FPGA_B0B1 (U2.J14)
LA03_n: S7CAS-PLEIADES-CARTE-MERE_P02_CONNECTORS (J1.G10), S7CAS-PLEIADES-CARTE-MERE_P02_FPGA_B0B1 (U2.D15)
LA03_p: S7CAS-PLEIADES-CARTE-MERE_P02_CONNECTORS (J1.G9), S7CAS-PLEIADES-CARTE-MERE_P02_FPGA_B0B1 (U2.E14)
LA04_n: S7CAS-PLEIADES-CARTE-MERE_P02_CONNECTORS (J1.H11), S7CAS-PLEIADES-CARTE-MERE_P02_FPGA_B0B1 (U2.C16)
LA04_p: S7CAS-PLEIADES-CARTE-MERE_P02_CONNECTORS (J1.H10), S7CAS-PLEIADES-CARTE-MERE_P02_FPGA_B0B1 (U2.D16)
LA05_n: S7CAS-PLEIADES-CARTE-MERE_P02_CONNECTORS (J1.D12), S7CAS-PLEIADES-CARTE-MERE_P02_FPGA_B0B1 (U2.F15)
LA05_p: S7CAS-PLEIADES-CARTE-MERE_P02_CONNECTORS (J1.D11), S7CAS-PLEIADES-CARTE-MERE_P02_FPGA_B0B1 (U2.G16)
LA06_n: S7CAS-PLEIADES-CARTE-MERE_P02_CONNECTORS (J1.C11), S7CAS-PLEIADES-CARTE-MERE_P02_FPGA_B0B1 (U2.E17)
LA06_p: S7CAS-PLEIADES-CARTE-MERE_P02_CONNECTORS (J1.C10), S7CAS-PLEIADES-CARTE-MERE_P02_FPGA_B0B1 (U2.F17)
LA07_n: S7CAS-PLEIADES-CARTE-MERE_P02_CONNECTORS (J1.H14), S7CAS-PLEIADES-CARTE-MERE_P02_FPGA_B0B1 (U2.E16)
LA07_p: S7CAS-PLEIADES-CARTE-MERE_P02_CONNECTORS (J1.H13), S7CAS-PLEIADES-CARTE-MERE_P02_FPGA_B0B1 (U2.F16)
LA08_n: S7CAS-PLEIADES-CARTE-MERE_P02_CONNECTORS (J1.G13), S7CAS-PLEIADES-CARTE-MERE_P02_FPGA_B0B1 (U2.A17)
LA08_p: S7CAS-PLEIADES-CARTE-MERE_P02_CONNECTORS (J1.G12), S7CAS-PLEIADES-CARTE-MERE_P02_FPGA_B0B1 (U2.C17)
LA09_n: S7CAS-PLEIADES-CARTE-MERE_P02_CONNECTORS (J1.D15), S7CAS-PLEIADES-CARTE-MERE_P02_FPGA_B0B1 (U2.H15)
LA09_p: S7CAS-PLEIADES-CARTE-MERE_P02_CONNECTORS (J1.D14), S7CAS-PLEIADES-CARTE-MERE_P02_FPGA_B0B1 (U2.J15)
LA10_n: S7CAS-PLEIADES-CARTE-MERE_P02_CONNECTORS (J1.C15), S7CAS-PLEIADES-CARTE-MERE_P02_FPGA_B0B1 (U2.C18)
LA10_p: S7CAS-PLEIADES-CARTE-MERE_P02_CONNECTORS (J1.C14), S7CAS-PLEIADES-CARTE-MERE_P02_FPGA_B0B1 (U2.D18)
LA11_n: S7CAS-PLEIADES-CARTE-MERE_P02_CONNECTORS (J1.H17), S7CAS-PLEIADES-CARTE-MERE_P02_FPGA_B0B1 (U2.D19)
LA11_p: S7CAS-PLEIADES-CARTE-MERE_P02_CONNECTORS (J1.H16), S7CAS-PLEIADES-CARTE-MERE_P02_FPGA_B0B1 (U2.E19)
LA12_n: S7CAS-PLEIADES-CARTE-MERE_P02_CONNECTORS (J1.G16), S7CAS-PLEIADES-CARTE-MERE_P02_FPGA_B0B1 (U2.G17)
LA12_p: S7CAS-PLEIADES-CARTE-MERE_P02_CONNECTORS (J1.G15), S7CAS-PLEIADES-CARTE-MERE_P02_FPGA_B0B1 (U2.H16)
LA13_n: S7CAS-PLEIADES-CARTE-MERE_P02_CONNECTORS (J1.D18), S7CAS-PLEIADES-CARTE-MERE_P02_FPGA_B0B1 (U2.C20)
LA13_p: S7CAS-PLEIADES-CARTE-MERE_P02_CONNECTORS (J1.D17), S7CAS-PLEIADES-CARTE-MERE_P02_FPGA_B0B1 (U2.D21)
LA14_n: S7CAS-PLEIADES-CARTE-MERE_P02_CONNECTORS (J1.C19), S7CAS-PLEIADES-CARTE-MERE_P02_FPGA_B0B1 (U2.E18)
LA14_p: S7CAS-PLEIADES-CARTE-MERE_P02_CONNECTORS (J1.C18), S7CAS-PLEIADES-CARTE-MERE_P02_FPGA_B0B1 (U2.F18)
LA15_n: S7CAS-PLEIADES-CARTE-MERE_P02_CONNECTORS (J1.H20), S7CAS-PLEIADES-CARTE-MERE_P02_FPGA_B0B1 (U2.D20)
LA15_p: S7CAS-PLEIADES-CARTE-MERE_P02_CONNECTORS (J1.H19), S7CAS-PLEIADES-CARTE-MERE_P02_FPGA_B0B1 (U2.E20)
LA16_n: S7CAS-PLEIADES-CARTE-MERE_P02_CONNECTORS (J1.G19), S7CAS-PLEIADES-CARTE-MERE_P02_FPGA_B0B1 (U2.H17)
LA16_p: S7CAS-PLEIADES-CARTE-MERE_P02_CONNECTORS (J1.G18), S7CAS-PLEIADES-CARTE-MERE_P02_FPGA_B0B1 (U2.J17)
LA17_CC_n: S7CAS-PLEIADES-CARTE-MERE_P02_CONNECTORS (J1.D21), S7CAS-PLEIADES-CARTE-MERE_P02_FPGA_B0B1 (U2.B18)
LA17_CC_p: S7CAS-PLEIADES-CARTE-MERE_P02_CONNECTORS (J1.D20), S7CAS-PLEIADES-CARTE-MERE_P02_FPGA_B0B1 (U2.A18)
LA18_CC_n: S7CAS-PLEIADES-CARTE-MERE_P02_CONNECTORS (J1.C23), S7CAS-PLEIADES-CARTE-MERE_P02_FPGA_B0B1 (U2.C19)
LA18_CC_p: S7CAS-PLEIADES-CARTE-MERE_P02_CONNECTORS (J1.C22), S7CAS-PLEIADES-CARTE-MERE_P02_FPGA_B0B1 (U2.A19)
LA19_n: S7CAS-PLEIADES-CARTE-MERE_P02_CONNECTORS (J1.H23), S7CAS-PLEIADES-CARTE-MERE_P02_FPGA_B0B1 (U2.B20)
LA19_p: S7CAS-PLEIADES-CARTE-MERE_P02_CONNECTORS (J1.H22), S7CAS-PLEIADES-CARTE-MERE_P02_FPGA_B0B1 (U2.A20)
LA20_n: S7CAS-PLEIADES-CARTE-MERE_P02_CONNECTORS (J1.G22), S7CAS-PLEIADES-CARTE-MERE_P02_FPGA_B0B1 (U2.C21)
LA20_p: S7CAS-PLEIADES-CARTE-MERE_P02_CONNECTORS (J1.G21), S7CAS-PLEIADES-CARTE-MERE_P02_FPGA_B0B1 (U2.A21)
LA21_n: S7CAS-PLEIADES-CARTE-MERE_P02_CONNECTORS (J1.H26), S7CAS-PLEIADES-CARTE-MERE_P02_FPGA_B0B1 (U2.B22)
LA21_p: S7CAS-PLEIADES-CARTE-MERE_P02_CONNECTORS (J1.H25), S7CAS-PLEIADES-CARTE-MERE_P02_FPGA_B0B1 (U2.A22)
LA22_n: S7CAS-PLEIADES-CARTE-MERE_P02_CONNECTORS (J1.G25), S7CAS-PLEIADES-CARTE-MERE_P02_FPGA_B0B1 (U2.D13)
LA22_p: S7CAS-PLEIADES-CARTE-MERE_P02_CONNECTORS (J1.G24), S7CAS-PLEIADES-CARTE-MERE_P02_FPGA_B0B1 (U2.F13)
LA23_n: S7CAS-PLEIADES-CARTE-MERE_P02_CONNECTORS (J1.D24), S7CAS-PLEIADES-CARTE-MERE_P02_FPGA_B2B3 (U2.AD15)
LA23_p: S7CAS-PLEIADES-CARTE-MERE_P02_CONNECTORS (J1.D23), S7CAS-PLEIADES-CARTE-MERE_P02_FPGA_B2B3 (U2.AC15)
LA24_n: S7CAS-PLEIADES-CARTE-MERE_P02_CONNECTORS (J1.H29), S7CAS-PLEIADES-CARTE-MERE_P02_FPGA_B2B3 (U2.AC17)
LA24_p: S7CAS-PLEIADES-CARTE-MERE_P02_CONNECTORS (J1.H28), S7CAS-PLEIADES-CARTE-MERE_P02_FPGA_B2B3 (U2.AB17)
LA25_n: S7CAS-PLEIADES-CARTE-MERE_P02_CONNECTORS (J1.G28), S7CAS-PLEIADES-CARTE-MERE_P02_FPGA_B2B3 (U2.AF15)
LA25_p: S7CAS-PLEIADES-CARTE-MERE_P02_CONNECTORS (J1.G27), S7CAS-PLEIADES-CARTE-MERE_P02_FPGA_B2B3 (U2.AE15)
LA26_n: S7CAS-PLEIADES-CARTE-MERE_P02_CONNECTORS (J1.D27), S7CAS-PLEIADES-CARTE-MERE_P02_FPGA_B2B3 (U2.AF17)
LA26_p: S7CAS-PLEIADES-CARTE-MERE_P02_CONNECTORS (J1.D26), S7CAS-PLEIADES-CARTE-MERE_P02_FPGA_B2B3 (U2.AE17)
LA27_n: S7CAS-PLEIADES-CARTE-MERE_P02_CONNECTORS (J1.C27), S7CAS-PLEIADES-CARTE-MERE_P02_FPGA_B2B3 (U2.AB18)
LA27_p: S7CAS-PLEIADES-CARTE-MERE_P02_CONNECTORS (J1.C26), S7CAS-PLEIADES-CARTE-MERE_P02_FPGA_B2B3 (U2.AA18)
LA28_n: S7CAS-PLEIADES-CARTE-MERE_P02_CONNECTORS (J1.H32), S7CAS-PLEIADES-CARTE-MERE_P02_FPGA_B2B3 (U2.AA17)
LA28_p: S7CAS-PLEIADES-CARTE-MERE_P02_CONNECTORS (J1.H31), S7CAS-PLEIADES-CARTE-MERE_P02_FPGA_B2B3 (U2.Y16)
LA29_n: S7CAS-PLEIADES-CARTE-MERE_P02_CONNECTORS (J1.G31), S7CAS-PLEIADES-CARTE-MERE_P02_FPGA_B2B3 (U2.AF18)
LA29_p: S7CAS-PLEIADES-CARTE-MERE_P02_CONNECTORS (J1.G30), S7CAS-PLEIADES-CARTE-MERE_P02_FPGA_B2B3 (U2.AD18)
LA30_n: S7CAS-PLEIADES-CARTE-MERE_P02_CONNECTORS (J1.H35), S7CAS-PLEIADES-CARTE-MERE_P02_FPGA_B2B3 (U2.W17)
LA30_p: S7CAS-PLEIADES-CARTE-MERE_P02_CONNECTORS (J1.H34), S7CAS-PLEIADES-CARTE-MERE_P02_FPGA_B2B3 (U2.V16)
LA31_n: S7CAS-PLEIADES-CARTE-MERE_P02_CONNECTORS (J1.G34), S7CAS-PLEIADES-CARTE-MERE_P02_FPGA_B2B3 (U2.AD19)
LA31_p: S7CAS-PLEIADES-CARTE-MERE_P02_CONNECTORS (J1.G33), S7CAS-PLEIADES-CARTE-MERE_P02_FPGA_B2B3 (U2.AC19)
LA32_n: S7CAS-PLEIADES-CARTE-MERE_P02_CONNECTORS (J1.H38), S7CAS-PLEIADES-CARTE-MERE_P02_FPGA_B2B3 (U2.AA19)
LA32_p: S7CAS-PLEIADES-CARTE-MERE_P02_CONNECTORS (J1.H37), S7CAS-PLEIADES-CARTE-MERE_P02_FPGA_B2B3 (U2.Y18)
LA33_n: S7CAS-PLEIADES-CARTE-MERE_P02_CONNECTORS (J1.G37), S7CAS-PLEIADES-CARTE-MERE_P02_FPGA_B2B3 (U2.AD21)
LA33_p: S7CAS-PLEIADES-CARTE-MERE_P02_CONNECTORS (J1.G36), S7CAS-PLEIADES-CARTE-MERE_P02_FPGA_B2B3 (U2.AC20)
LDQS_N: S7CAS-PLEIADES-CARTE-MERE_P02_FPGA_B2B3 (U2.V1), S7CAS-PLEIADES-CARTE-MERE_P02_DDR3 (U1.G3)
LDQS_P: S7CAS-PLEIADES-CARTE-MERE_P02_FPGA_B2B3 (U2.V3), S7CAS-PLEIADES-CARTE-MERE_P02_DDR3 (U1.F3)
MOTOR_DECAY: S7CAS-PLEIADES-CARTE-MERE_P02_FPGA_B0B1 (U2.U23), S7CAS-PLEIADES-CARTE-MERE_P02_MOTOR_CTRL (C118.2 U7.5)
MOTOR_DIR: S7CAS-PLEIADES-CARTE-MERE_P02_FPGA_B0B1 (U2.R19), S7CAS-PLEIADES-CARTE-MERE_P02_MOTOR_CTRL (U7.3)
MOTOR_HOME: S7CAS-PLEIADES-CARTE-MERE_P02_FPGA_B0B1 (U2.P18), S7CAS-PLEIADES-CARTE-MERE_P02_MOTOR_CTRL (U7.2)
MOTOR_STEP: S7CAS-PLEIADES-CARTE-MERE_P02_FPGA_B0B1 (U2.R20), S7CAS-PLEIADES-CARTE-MERE_P02_MOTOR_CTRL (U7.19)
MOTOR_USM0: S7CAS-PLEIADES-CARTE-MERE_P02_FPGA_B0B1 (U2.R17), S7CAS-PLEIADES-CARTE-MERE_P02_MOTOR_CTRL (U7.13)
MOTOR_USM1: S7CAS-PLEIADES-CARTE-MERE_P02_FPGA_B0B1 (U2.R18), S7CAS-PLEIADES-CARTE-MERE_P02_MOTOR_CTRL (U7.12)
PG_C2M: S7CAS-PLEIADES-CARTE-MERE_P02_CONNECTORS (J1.D1), S7CAS-PLEIADES-CARTE-MERE_P02_FPGA_B0B1 (U2.L23)
PG_M2C: S7CAS-PLEIADES-CARTE-MERE_P02_CONNECTORS (J1.F1), S7CAS-PLEIADES-CARTE-MERE_P02_FPGA_B0B1 (U2.L24)
PHY_25MHz: S7CAS-PLEIADES-CARTE-MERE_P02_FPGA_B0B1 (U2.U25), S7CAS-PLEIADES-CARTE-MERE_P02_ETHERNET (U5.9)
PHY_COL: S7CAS-PLEIADES-CARTE-MERE_P02_FPGA_B0B1 (U2.V26), S7CAS-PLEIADES-CARTE-MERE_P02_ETHERNET (U5.28)
PHY_CRS: S7CAS-PLEIADES-CARTE-MERE_P02_FPGA_B0B1 (U2.T24), S7CAS-PLEIADES-CARTE-MERE_P02_ETHERNET (U5.29)
PHY_INTR: S7CAS-PLEIADES-CARTE-MERE_P02_FPGA_B0B1 (U2.V24), S7CAS-PLEIADES-CARTE-MERE_P02_ETHERNET (U5.21)
PHY_MDC: S7CAS-PLEIADES-CARTE-MERE_P02_FPGA_B0B1 (U2.W26), S7CAS-PLEIADES-CARTE-MERE_P02_ETHERNET (U5.12)
PHY_MDIO: S7CAS-PLEIADES-CARTE-MERE_P02_FPGA_B0B1 (U2.W25), S7CAS-PLEIADES-CARTE-MERE_P02_ETHERNET (U5.11)
PHY_RXC: S7CAS-PLEIADES-CARTE-MERE_P02_FPGA_B0B1 (U2.Y26), S7CAS-PLEIADES-CARTE-MERE_P02_ETHERNET (R55.2)
PHY_RXD0: S7CAS-PLEIADES-CARTE-MERE_P02_FPGA_B0B1 (U2.AD24), S7CAS-PLEIADES-CARTE-MERE_P02_ETHERNET (R51.2)
PHY_RXD1: S7CAS-PLEIADES-CARTE-MERE_P02_FPGA_B0B1 (U2.AD26), S7CAS-PLEIADES-CARTE-MERE_P02_ETHERNET (R52.2)
PHY_RXD2: S7CAS-PLEIADES-CARTE-MERE_P02_FPGA_B0B1 (U2.AB24), S7CAS-PLEIADES-CARTE-MERE_P02_ETHERNET (R53.2)
PHY_RXD3: S7CAS-PLEIADES-CARTE-MERE_P02_FPGA_B0B1 (U2.AB26), S7CAS-PLEIADES-CARTE-MERE_P02_ETHERNET (R54.2)
PHY_RXDV: S7CAS-PLEIADES-CARTE-MERE_P02_FPGA_B0B1 (U2.T26), S7CAS-PLEIADES-CARTE-MERE_P02_ETHERNET (R47.2)
PHY_RXER: S7CAS-PLEIADES-CARTE-MERE_P02_FPGA_B0B1 (U2.Y24), S7CAS-PLEIADES-CARTE-MERE_P02_ETHERNET (R49.2)
PHY_TXC: S7CAS-PLEIADES-CARTE-MERE_P02_FPGA_B0B1 (U2.N19), S7CAS-PLEIADES-CARTE-MERE_P02_ETHERNET (U5.22)
PHY_TXD0: S7CAS-PLEIADES-CARTE-MERE_P02_FPGA_B0B1 (U2.N17), S7CAS-PLEIADES-CARTE-MERE_P02_ETHERNET (U5.24)
PHY_TXD1: S7CAS-PLEIADES-CARTE-MERE_P02_FPGA_B0B1 (U2.N18), S7CAS-PLEIADES-CARTE-MERE_P02_ETHERNET (U5.25)
PHY_TXD2: S7CAS-PLEIADES-CARTE-MERE_P02_FPGA_B0B1 (U2.R23), S7CAS-PLEIADES-CARTE-MERE_P02_ETHERNET (U5.26)
PHY_TXD3: S7CAS-PLEIADES-CARTE-MERE_P02_FPGA_B0B1 (U2.R24), S7CAS-PLEIADES-CARTE-MERE_P02_ETHERNET (U5.27)
PHY_TXEN: S7CAS-PLEIADES-CARTE-MERE_P02_FPGA_B0B1 (U2.N23), S7CAS-PLEIADES-CARTE-MERE_P02_ETHERNET (U5.23)
PHY_TXER: S7CAS-PLEIADES-CARTE-MERE_P02_FPGA_B0B1 (U2.N22), S7CAS-PLEIADES-CARTE-MERE_P02_ETHERNET (U5.31)
PLL_LOCK: S7CAS-PLEIADES-CARTE-MERE_P02_FPGA_B2B3 (U2.AF16), S7CAS-PLEIADES-CARTE-MERE_P02_CLOCKS (U3.37)
PRST#: S7CAS-PLEIADES-CARTE-MERE_P02_CONNECTORS (J1.H2), S7CAS-PLEIADES-CARTE-MERE_P02_FPGA_B2B3 (U2.AD16)
SCL: S7CAS-PLEIADES-CARTE-MERE_P02_CONNECTORS (J1.C30), S7CAS-PLEIADES-CARTE-MERE_P02_FPGA_B0B1 (R59.1 U2.V17), S7CAS-PLEIADES-CARTE-MERE_P02_USER_IO (U21.4 U22.4)
SDA: S7CAS-PLEIADES-CARTE-MERE_P02_CONNECTORS (J1.C31), S7CAS-PLEIADES-CARTE-MERE_P02_FPGA_B0B1 (R58.1 U2.U17), S7CAS-PLEIADES-CARTE-MERE_P02_USER_IO (U21.5 U22.5)
SLP_S3: S7CAS-PLEIADES-CARTE-MERE_P02_POWER_CARRIER (U16.7), S7CAS-PLEIADES-CARTE-MERE_P02_FPGA_B2B3 (U2.L7)
SPI_CLK: S7CAS-PLEIADES-CARTE-MERE_P02_FPGA_B2B3 (U2.AD22), S7CAS-PLEIADES-CARTE-MERE_P02_CLOCKS (U3.24), S7CAS-PLEIADES-CARTE-MERE_P02_FLASH (U6.6)
SPI_MOSI: S7CAS-PLEIADES-CARTE-MERE_P02_FPGA_B2B3 (U2.AF21), S7CAS-PLEIADES-CARTE-MERE_P02_CLOCKS (U3.23), S7CAS-PLEIADES-CARTE-MERE_P02_FLASH (U6.5)
UART_CTS#: S7CAS-PLEIADES-CARTE-MERE_P02_FPGA_B0B1 (U2.R26), S7CAS-PLEIADES-CARTE-MERE_P02_USB (U19.11)
UART_RTS#: S7CAS-PLEIADES-CARTE-MERE_P02_FPGA_B0B1 (U2.P26), S7CAS-PLEIADES-CARTE-MERE_P02_USB (U19.13)
UART_RXD: S7CAS-PLEIADES-CARTE-MERE_P02_FPGA_B0B1 (U2.R25), S7CAS-PLEIADES-CARTE-MERE_P02_USB (U19.12)
UART_TXD: S7CAS-PLEIADES-CARTE-MERE_P02_FPGA_B0B1 (U2.P24), S7CAS-PLEIADES-CARTE-MERE_P02_USB (U19.14)
UDQS_N: S7CAS-PLEIADES-CARTE-MERE_P02_FPGA_B2B3 (U2.AC1), S7CAS-PLEIADES-CARTE-MERE_P02_DDR3 (U1.B7)
UDQS_P: S7CAS-PLEIADES-CARTE-MERE_P02_FPGA_B2B3 (U2.AC2), S7CAS-PLEIADES-CARTE-MERE_P02_DDR3 (U1.C7)